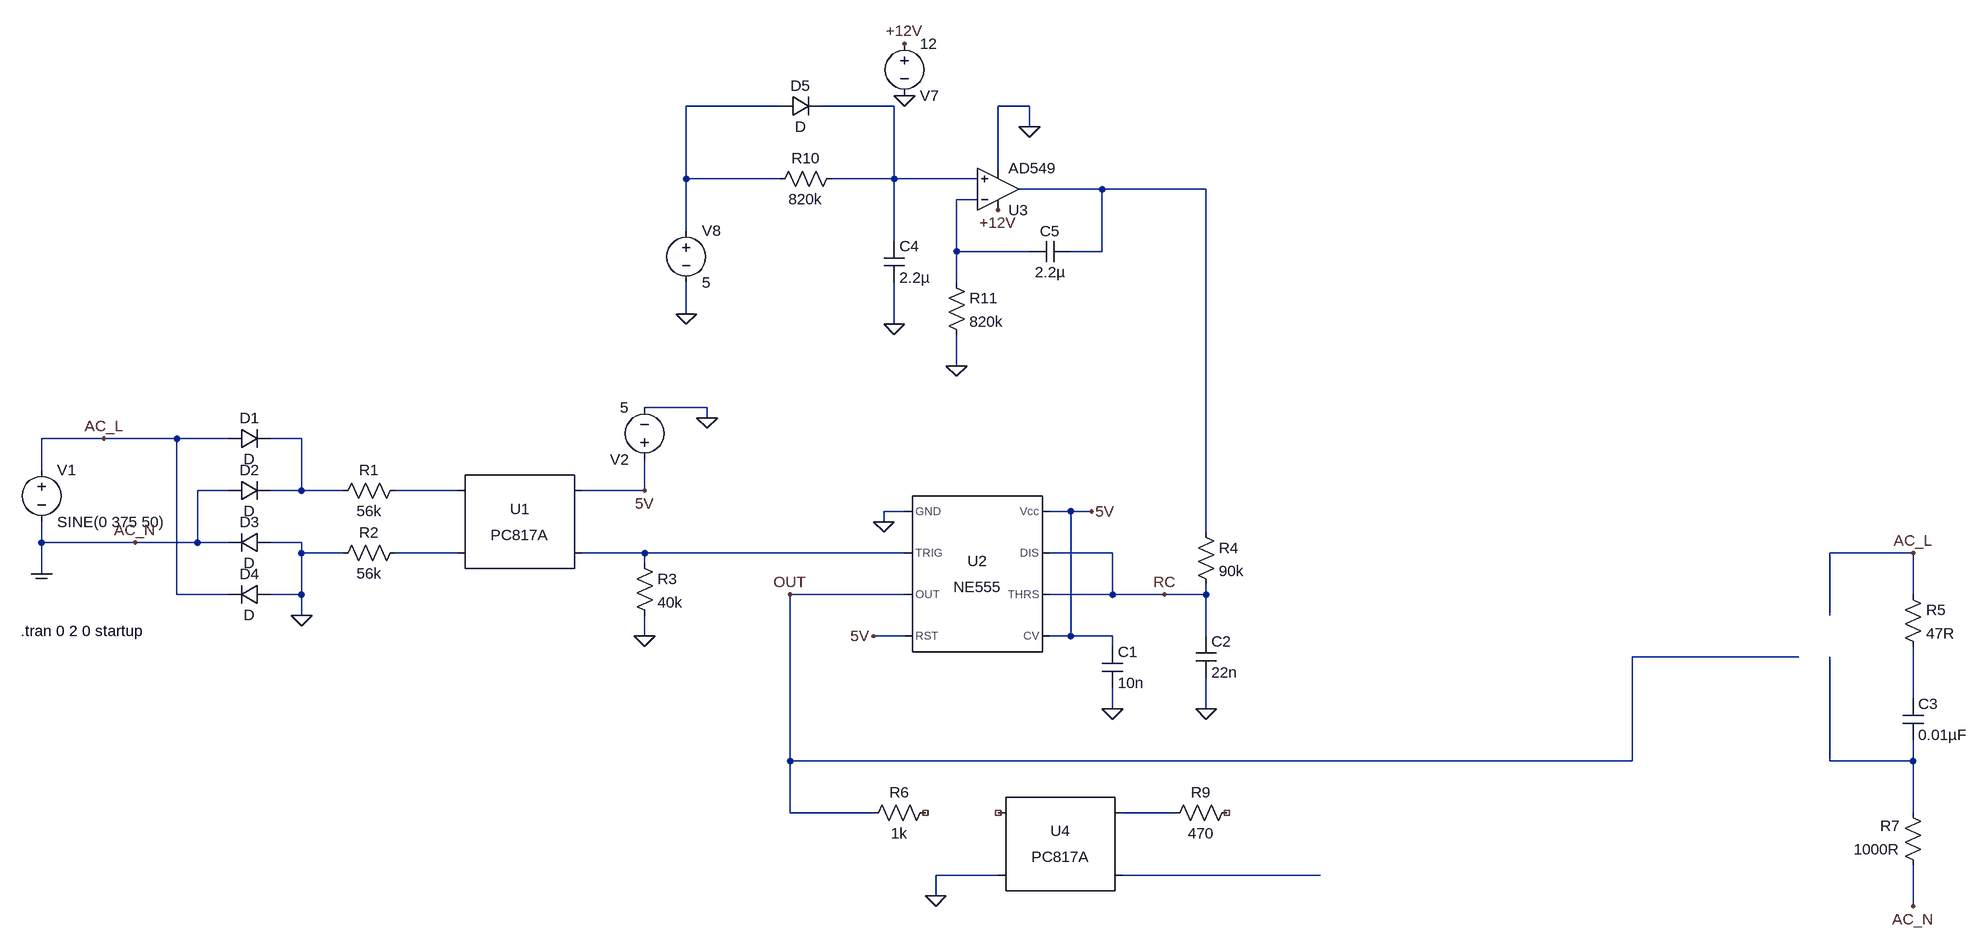
[diagram p0: schematic Draft1.asc]
Draft1.asc, the LTspice schematic file:
Version 4
SHEET 1 3312 888
WIRE 1056 -496 912 -496
WIRE 1232 -496 1120 -496
WIRE 1440 -496 1392 -496
WIRE 1440 -464 1440 -496
WIRE 1392 -400 1392 -496
WIRE 912 -384 912 -496
WIRE 1056 -384 912 -384
WIRE 1232 -384 1232 -496
WIRE 1232 -384 1136 -384
WIRE 1360 -384 1232 -384
WIRE 1552 -368 1424 -368
WIRE 1712 -368 1552 -368
WIRE 1360 -352 1328 -352
WIRE 912 -304 912 -384
WIRE 1232 -288 1232 -384
WIRE 1328 -272 1328 -352
WIRE 1440 -272 1328 -272
WIRE 1552 -272 1552 -368
WIRE 1552 -272 1504 -272
WIRE 1328 -224 1328 -272
WIRE 912 -176 912 -224
WIRE 1232 -160 1232 -224
WIRE 1328 -96 1328 -144
WIRE 944 -32 848 -32
WIRE 944 -16 944 -32
WIRE 16 16 -80 16
WIRE 128 16 16 16
WIRE 208 16 128 16
WIRE 320 16 272 16
WIRE -80 64 -80 16
WIRE 208 96 160 96
WIRE 320 96 320 16
WIRE 320 96 272 96
WIRE 384 96 320 96
WIRE 560 96 464 96
WIRE 848 96 848 48
WIRE 848 96 752 96
WIRE 1248 128 1216 128
WIRE 1504 128 1472 128
WIRE 1536 128 1504 128
WIRE 1216 144 1216 128
WIRE 1712 160 1712 -368
WIRE -80 176 -80 144
WIRE 64 176 -80 176
WIRE 160 176 160 96
WIRE 160 176 64 176
WIRE 208 176 160 176
WIRE 320 176 272 176
WIRE 320 192 320 176
WIRE 384 192 320 192
WIRE 560 192 464 192
WIRE 848 192 752 192
WIRE 1248 192 848 192
WIRE 1568 192 1472 192
WIRE 2800 192 2672 192
WIRE 848 208 848 192
WIRE -80 224 -80 176
WIRE 128 256 128 16
WIRE 208 256 128 256
WIRE 320 256 320 192
WIRE 320 256 272 256
WIRE 1248 256 1072 256
WIRE 1568 256 1568 192
WIRE 1568 256 1472 256
WIRE 1648 256 1568 256
WIRE 1712 256 1712 240
WIRE 1712 256 1648 256
WIRE 2800 256 2800 192
WIRE 320 288 320 256
WIRE 2672 288 2672 192
WIRE 848 320 848 288
WIRE 1248 320 1200 320
WIRE 1504 320 1504 128
WIRE 1504 320 1472 320
WIRE 1568 320 1504 320
WIRE 1712 320 1712 256
WIRE 1568 336 1568 320
WIRE 2624 352 2368 352
WIRE 2800 416 2800 336
WIRE 1568 432 1568 400
WIRE 1712 432 1712 384
WIRE 1072 512 1072 256
WIRE 2368 512 2368 352
WIRE 2368 512 1072 512
WIRE 2672 512 2672 352
WIRE 2800 512 2800 480
WIRE 2800 512 2672 512
WIRE 1072 592 1072 512
WIRE 1200 592 1072 592
WIRE 1664 592 1584 592
WIRE 2800 592 2800 512
WIRE 1392 688 1296 688
WIRE 1888 688 1584 688
WIRE 1296 720 1296 688
WIRE 2800 736 2800 672
FLAG 320 288 0
FLAG 848 320 0
FLAG 944 -16 0
FLAG -80 224 COM
FLAG 1216 144 0
FLAG 848 96 5V
FLAG 1536 128 5V
FLAG 1200 320 5V
FLAG 1568 432 0
FLAG 16 16 AC_L
FLAG 2800 192 AC_L
FLAG 2800 736 AC_N
FLAG 64 176 AC_N
FLAG 1296 720 0
FLAG 1072 256 OUT
FLAG 1648 256 RC
FLAG 1328 -96 0
FLAG 1232 -160 0
FLAG 912 -176 0
FLAG 1248 -512 0
FLAG 1248 -592 +12V
FLAG 1392 -336 +12V
FLAG 1440 -464 0
FLAG 1712 432 0
SYMBOL diode 208 32 R270
WINDOW 0 32 32 VTop 2
WINDOW 3 0 32 VBottom 2
SYMATTR InstName D1
SYMBOL diode 208 112 R270
WINDOW 0 32 32 VTop 2
WINDOW 3 0 32 VBottom 2
SYMATTR InstName D2
SYMBOL diode 272 160 R90
WINDOW 0 0 32 VBottom 2
WINDOW 3 32 32 VTop 2
SYMATTR InstName D3
SYMBOL diode 272 240 R90
WINDOW 0 0 32 VBottom 2
WINDOW 3 32 32 VTop 2
SYMATTR InstName D4
SYMBOL voltage -80 48 R0
WINDOW 123 0 0 Left 0
WINDOW 39 0 0 Left 0
SYMATTR InstName V1
SYMATTR Value SINE(0 375 50)
SYMBOL Optos\\PC817A 656 144 R0
SYMATTR InstName U1
SYMBOL res 480 80 R90
WINDOW 0 0 56 VBottom 2
WINDOW 3 32 56 VTop 2
SYMATTR InstName R1
SYMATTR Value 56k
SYMBOL res 480 176 R90
WINDOW 0 0 56 VBottom 2
WINDOW 3 32 56 VTop 2
SYMATTR InstName R2
SYMATTR Value 56k
SYMBOL res 832 192 R0
SYMATTR InstName R3
SYMATTR Value 40k
SYMBOL voltage 848 64 R180
WINDOW 123 0 0 Left 0
WINDOW 39 0 0 Left 0
SYMATTR InstName V2
SYMATTR Value 5
SYMBOL Misc\\NE555 1360 224 R0
SYMATTR InstName U2
SYMBOL cap 1552 336 R0
SYMATTR InstName C1
SYMATTR Value 10n
SYMBOL cap 1696 320 R0
SYMATTR InstName C2
SYMATTR Value 22n
SYMBOL res 1696 144 R0
SYMATTR InstName R4
SYMATTR Value 90k
SYMBOL cap 2784 416 R0
SYMATTR InstName C3
SYMATTR Value 0.01µF
SYMBOL res 2784 240 R0
SYMATTR InstName R5
SYMATTR Value 47R
SYMBOL res 2816 688 R180
WINDOW 0 36 76 Left 2
WINDOW 3 36 40 Left 2
SYMATTR InstName R7
SYMATTR Value 1000R
SYMBOL Optos\\PC817A 1488 640 R0
SYMATTR InstName U4
SYMBOL res 1296 576 R90
WINDOW 0 0 56 VBottom 2
WINDOW 3 32 56 VTop 2
SYMATTR InstName R6
SYMATTR Value 1k
SYMBOL res 1760 576 R90
WINDOW 0 0 56 VBottom 2
WINDOW 3 32 56 VTop 2
SYMATTR InstName R9
SYMATTR Value 470
SYMBOL OpAmps\\AD549 1392 -304 M180
SYMATTR InstName U3
SYMBOL res 1152 -400 R90
WINDOW 0 0 56 VBottom 2
WINDOW 3 32 56 VTop 2
SYMATTR InstName R10
SYMATTR Value 820k
SYMBOL cap 1216 -288 R0
SYMATTR InstName C4
SYMATTR Value 2.2µ
SYMBOL res 1312 -240 R0
SYMATTR InstName R11
SYMATTR Value 820k
SYMBOL cap 1504 -288 R90
WINDOW 0 0 32 VBottom 2
WINDOW 3 32 32 VTop 2
SYMATTR InstName C5
SYMATTR Value 2.2µ
SYMBOL voltage 1248 -608 R0
WINDOW 0 24 96 Left 2
WINDOW 3 24 16 Left 2
WINDOW 123 0 0 Left 0
WINDOW 39 0 0 Left 0
SYMATTR InstName V7
SYMATTR Value 12
SYMBOL voltage 912 -320 R0
WINDOW 123 0 0 Left 0
WINDOW 39 0 0 Left 0
SYMATTR InstName V8
SYMATTR Value 5
SYMBOL diode 1056 -480 R270
WINDOW 0 32 32 VTop 2
WINDOW 3 0 32 VBottom 2
SYMATTR InstName D5
TEXT -112 312 Left 2 !.tran 0 2 0 startup

The netlist it stands for:
* Draft1.asc
D1 AC_L N005 D
D2 AC_N N005 D
D3 0 AC_N D
D4 0 AC_L D
V1 AC_L AC_N SINE(0 375 50)
XU1 N006 N007 5V N008 PC817 Igain=1m
R1 N006 N005 56k
R2 N007 0 56k
R3 N008 0 40k
V2 5V 0 5
XU2 0 N008 OUT 5V 5V RC RC 5V NE555  ; pins GND TRIG OUT RST CV THRS DIS Vcc
C1 5V 0 10n
C2 RC 0 22n
R4 N003 RC 90k
C3 N009 N010 0.01µF
R5 AC_L N009 47R
R7 AC_N N010 1000R
XU4 NC_01 0 N011 N012 PC817 Igain=1m
R6 NC_02 OUT 1k
R9 NC_03 N011 470
XU3 N002 N004 +12V 0 N003 AD549  ; pins In+ In- V+ V- OUT
R10 N002 N001 820k
C4 N002 0 2.2µ
R11 N004 0 820k
C5 N003 N004 2.2µ
V7 +12V 0 12
V8 N001 0 5
D5 N001 N002 D
.model D D
.lib standard.dio
.tran 0 2 0 startup
.lib PC817.sub
.lib NE555.sub
.backanno
.end